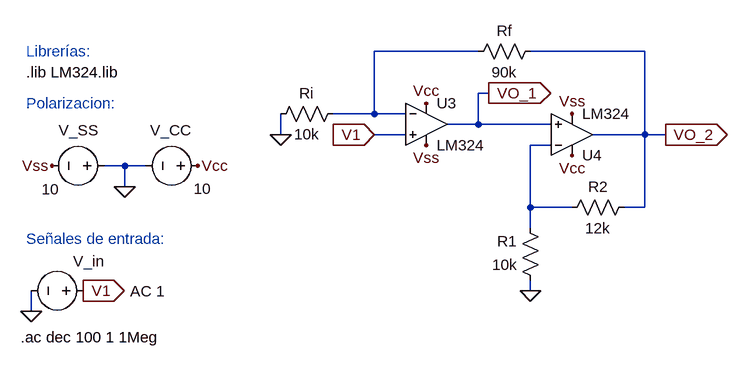
[diagram p0: schematic Lab_3_Circ_1-5.asc]
Lab_3_Circ_1-5.asc, the LTspice schematic file:
Version 4
SHEET 1 1764 680
WIRE 576 -432 416 -432
WIRE 832 -432 656 -432
WIRE 592 -368 576 -368
WIRE 416 -336 416 -432
WIRE 416 -336 352 -336
WIRE 464 -336 416 -336
WIRE 576 -320 576 -368
WIRE 576 -320 528 -320
WIRE 688 -320 576 -320
WIRE 272 -304 272 -336
WIRE 464 -304 416 -304
WIRE 832 -304 832 -432
WIRE 832 -304 752 -304
WIRE 864 -304 832 -304
WIRE 688 -288 656 -288
WIRE 32 -256 0 -256
WIRE 64 -256 32 -256
WIRE 32 -224 32 -256
WIRE 656 -192 656 -288
WIRE 720 -192 656 -192
WIRE 832 -192 832 -304
WIRE 832 -192 800 -192
WIRE 656 -160 656 -192
WIRE 656 -64 656 -80
WIRE -112 -32 -112 -64
FLAG 144 -256 Vcc
FLAG -80 -256 Vss
FLAG 32 -224 0
FLAG -112 -32 0
FLAG -32 -64 V1
IOPIN -32 -64 Out
FLAG 496 -352 Vcc
FLAG 496 -288 Vss
FLAG 416 -304 V1
IOPIN 416 -304 In
FLAG 864 -304 VO_2
IOPIN 864 -304 Out
FLAG 720 -272 Vcc
FLAG 720 -336 Vss
FLAG 272 -304 0
FLAG 592 -368 VO_1
IOPIN 592 -368 Out
FLAG 656 -64 0
SYMBOL voltage -16 -64 M270
WINDOW 0 45 31 VLeft 2
WINDOW 3 1 -53 VLeft 2
WINDOW 123 -1 -56 VLeft 2
WINDOW 39 0 0 Left 0
SYMATTR InstName V_in
SYMATTR Value ""
SYMATTR Value2 AC 1
SYMBOL voltage 160 -256 R90
WINDOW 0 -55 25 VRight 2
WINDOW 3 35 -5 VRight 2
WINDOW 123 0 0 Left 0
WINDOW 39 0 0 Left 0
SYMATTR InstName V_CC
SYMATTR Value 10
SYMBOL voltage 16 -256 R90
WINDOW 0 -55 25 VRight 2
WINDOW 3 36 85 VRight 2
WINDOW 123 0 0 Left 0
WINDOW 39 0 0 Left 0
SYMATTR InstName V_SS
SYMATTR Value 10
SYMBOL OpAmps\\opamp2 496 -384 R0
SYMATTR InstName U3
SYMATTR Value LM324
SYMBOL OpAmps\\opamp2 720 -240 M180
SYMATTR InstName U4
SYMATTR Value LM324
SYMBOL res 672 -448 R90
WINDOW 0 0 56 VBottom 2
WINDOW 3 32 56 VTop 2
SYMATTR InstName Rf
SYMATTR Value 90k
SYMBOL res 368 -352 R90
WINDOW 0 0 56 VBottom 2
WINDOW 3 32 56 VTop 2
SYMATTR InstName Ri
SYMATTR Value 10k
SYMBOL res 816 -208 R90
WINDOW 0 0 56 VBottom 2
WINDOW 3 32 56 VTop 2
SYMATTR InstName R2
SYMATTR Value 12k
SYMBOL res 672 -64 R180
WINDOW 0 36 76 Left 2
WINDOW 3 36 40 Left 2
SYMATTR InstName R1
SYMATTR Value 10k
TEXT -120 -400 Left 2 !.lib LM324.lib
TEXT -120 -432 Left 2 ;Librerías:
TEXT -120 -352 Left 2 ;Polarizacion:
TEXT -120 -144 Left 2 ;Señales de entrada:
TEXT -128 8 Left 2 !.ac dec 100 1 1Meg

The netlist it stands for:
* Lab_3_Circ_1-5.asc
V_in V1 0 AC 1
V_CC Vcc 0 10
V_SS 0 Vss 10
XU3 V1 N001 Vcc Vss VO_1 LM324  ; pins In+ In- V+ V- OUT
XU4 VO_1 N002 Vcc Vss VO_2 LM324  ; pins In+ In- V+ V- OUT
Rf VO_2 N001 90k
Ri N001 0 10k
R2 VO_2 N002 12k
R1 0 N002 10k
.lib LM324.lib
* Librerías:
* Polarizacion:
* Señales de entrada:
.ac dec 100 1 1Meg
.backanno
.end